# EasyEDA Pro project Armour_Round.eprj, schematic Schematic1
Create Date: 2023-03-10; Page Name: P1; Project Name: Armour_Round; Schematic Name: Schematic1; Update Date: 2023-03-13; Company: 嘉立创EDA; Page Size: A4; Version: V1.0
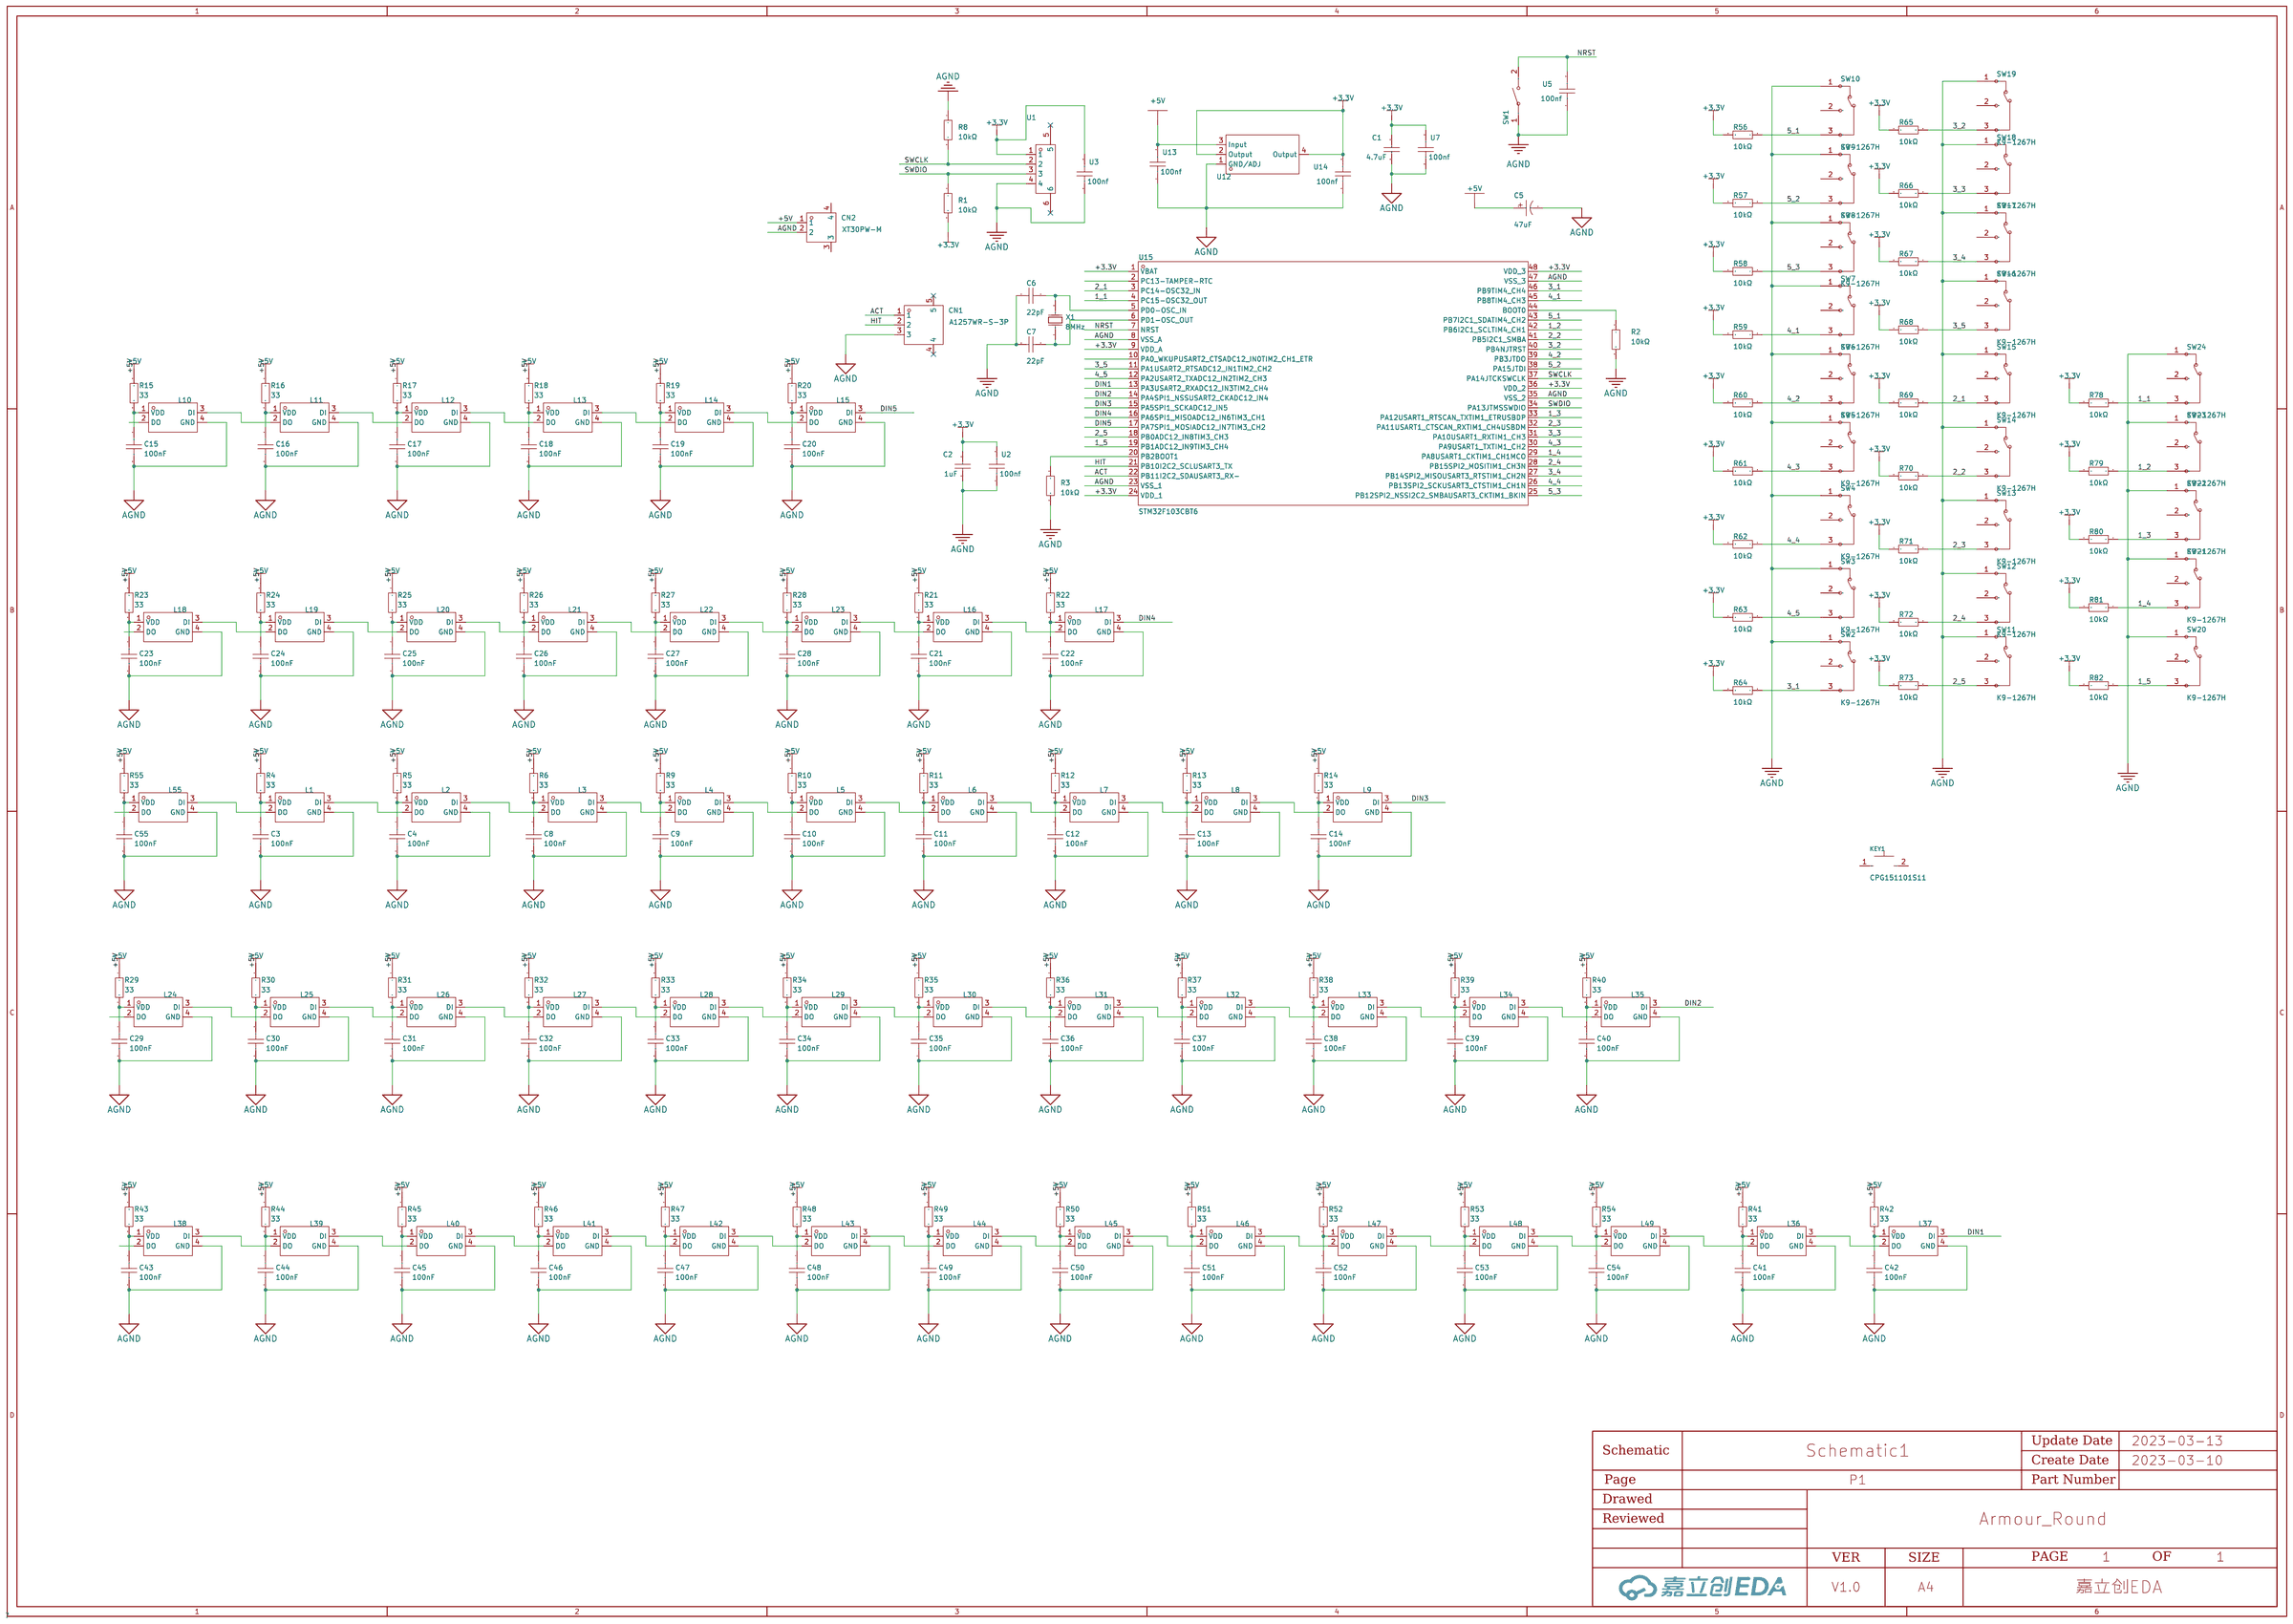
[diagram p0: schematic sheet]

## Parts
C1  4.7uF  [C0603]
C2  1uF  [C0603]
C3  100nF  [C0603]
C4  100nF  [C0603]
C5  47uF  [CAP-SMD_BD6.3-L6.6-W6.6-FD]
C6  22pF  [C0603]
C7  22pF  [C0603]
C8  100nF  [C0603]
C9  100nF  [C0603]
C10  100nF  [C0603]
C11  100nF  [C0603]
C12  100nF  [C0603]
C13  100nF  [C0603]
C14  100nF  [C0603]
C15  100nF  [C0603]
C16  100nF  [C0603]
C17  100nF  [C0603]
C18  100nF  [C0603]
C19  100nF  [C0603]
C20  100nF  [C0603]
C21  100nF  [C0603]
C22  100nF  [C0603]
C23  100nF  [C0603]
C24  100nF  [C0603]
C25  100nF  [C0603]
C26  100nF  [C0603]
C27  100nF  [C0603]
C28  100nF  [C0603]
C29  100nF  [C0603]
C30  100nF  [C0603]
C31  100nF  [C0603]
C32  100nF  [C0603]
C33  100nF  [C0603]
C34  100nF  [C0603]
C35  100nF  [C0603]
C36  100nF  [C0603]
C37  100nF  [C0603]
C38  100nF  [C0603]
C39  100nF  [C0603]
C40  100nF  [C0603]
C41  100nF  [C0603]
C42  100nF  [C0603]
C43  100nF  [C0603]
C44  100nF  [C0603]
C45  100nF  [C0603]
C46  100nF  [C0603]
C47  100nF  [C0603]
C48  100nF  [C0603]
C49  100nF  [C0603]
C50  100nF  [C0603]
C51  100nF  [C0603]
C52  100nF  [C0603]
C53  100nF  [C0603]
C54  100nF  [C0603]
C55  100nF  [C0603]
CN1  A1257WR-S-3P  [CONN-SMD_A1257WR-S-3P]
CN2  XT30PW-M  [CONN-TH_XT30PW-M]
KEY1  CPG151101S11  [TH_L10.9-W5.9-CPG151101S11]
L1  XL-5050RGBC-WS2812B  [LED-SMD_4P-L5.0-W5.0-BL_XL-5050RGBC]
L2  XL-5050RGBC-WS2812B  [LED-SMD_4P-L5.0-W5.0-BL_XL-5050RGBC]
L3  XL-5050RGBC-WS2812B  [LED-SMD_4P-L5.0-W5.0-BL_XL-5050RGBC]
L4  XL-5050RGBC-WS2812B  [LED-SMD_4P-L5.0-W5.0-BL_XL-5050RGBC]
L5  XL-5050RGBC-WS2812B  [LED-SMD_4P-L5.0-W5.0-BL_XL-5050RGBC]
L6  XL-5050RGBC-WS2812B  [LED-SMD_4P-L5.0-W5.0-BL_XL-5050RGBC]
L7  XL-5050RGBC-WS2812B  [LED-SMD_4P-L5.0-W5.0-BL_XL-5050RGBC]
L8  XL-5050RGBC-WS2812B  [LED-SMD_4P-L5.0-W5.0-BL_XL-5050RGBC]
L9  XL-5050RGBC-WS2812B  [LED-SMD_4P-L5.0-W5.0-BL_XL-5050RGBC]
L10  XL-5050RGBC-WS2812B  [LED-SMD_4P-L5.0-W5.0-BL_XL-5050RGBC]
L11  XL-5050RGBC-WS2812B  [LED-SMD_4P-L5.0-W5.0-BL_XL-5050RGBC]
L12  XL-5050RGBC-WS2812B  [LED-SMD_4P-L5.0-W5.0-BL_XL-5050RGBC]
L13  XL-5050RGBC-WS2812B  [LED-SMD_4P-L5.0-W5.0-BL_XL-5050RGBC]
L14  XL-5050RGBC-WS2812B  [LED-SMD_4P-L5.0-W5.0-BL_XL-5050RGBC]
L15  XL-5050RGBC-WS2812B  [LED-SMD_4P-L5.0-W5.0-BL_XL-5050RGBC]
L16  XL-5050RGBC-WS2812B  [LED-SMD_4P-L5.0-W5.0-BL_XL-5050RGBC]
L17  XL-5050RGBC-WS2812B  [LED-SMD_4P-L5.0-W5.0-BL_XL-5050RGBC]
L18  XL-5050RGBC-WS2812B  [LED-SMD_4P-L5.0-W5.0-BL_XL-5050RGBC]
L19  XL-5050RGBC-WS2812B  [LED-SMD_4P-L5.0-W5.0-BL_XL-5050RGBC]
L20  XL-5050RGBC-WS2812B  [LED-SMD_4P-L5.0-W5.0-BL_XL-5050RGBC]
L21  XL-5050RGBC-WS2812B  [LED-SMD_4P-L5.0-W5.0-BL_XL-5050RGBC]
L22  XL-5050RGBC-WS2812B  [LED-SMD_4P-L5.0-W5.0-BL_XL-5050RGBC]
L23  XL-5050RGBC-WS2812B  [LED-SMD_4P-L5.0-W5.0-BL_XL-5050RGBC]
L24  XL-5050RGBC-WS2812B  [LED-SMD_4P-L5.0-W5.0-BL_XL-5050RGBC]
L25  XL-5050RGBC-WS2812B  [LED-SMD_4P-L5.0-W5.0-BL_XL-5050RGBC]
L26  XL-5050RGBC-WS2812B  [LED-SMD_4P-L5.0-W5.0-BL_XL-5050RGBC]
L27  XL-5050RGBC-WS2812B  [LED-SMD_4P-L5.0-W5.0-BL_XL-5050RGBC]
L28  XL-5050RGBC-WS2812B  [LED-SMD_4P-L5.0-W5.0-BL_XL-5050RGBC]
L29  XL-5050RGBC-WS2812B  [LED-SMD_4P-L5.0-W5.0-BL_XL-5050RGBC]
L30  XL-5050RGBC-WS2812B  [LED-SMD_4P-L5.0-W5.0-BL_XL-5050RGBC]
L31  XL-5050RGBC-WS2812B  [LED-SMD_4P-L5.0-W5.0-BL_XL-5050RGBC]
L32  XL-5050RGBC-WS2812B  [LED-SMD_4P-L5.0-W5.0-BL_XL-5050RGBC]
L33  XL-5050RGBC-WS2812B  [LED-SMD_4P-L5.0-W5.0-BL_XL-5050RGBC]
L34  XL-5050RGBC-WS2812B  [LED-SMD_4P-L5.0-W5.0-BL_XL-5050RGBC]
L35  XL-5050RGBC-WS2812B  [LED-SMD_4P-L5.0-W5.0-BL_XL-5050RGBC]
L36  XL-5050RGBC-WS2812B  [LED-SMD_4P-L5.0-W5.0-BL_XL-5050RGBC]
L37  XL-5050RGBC-WS2812B  [LED-SMD_4P-L5.0-W5.0-BL_XL-5050RGBC]
L38  XL-5050RGBC-WS2812B  [LED-SMD_4P-L5.0-W5.0-BL_XL-5050RGBC]
L39  XL-5050RGBC-WS2812B  [LED-SMD_4P-L5.0-W5.0-BL_XL-5050RGBC]
L40  XL-5050RGBC-WS2812B  [LED-SMD_4P-L5.0-W5.0-BL_XL-5050RGBC]
L41  XL-5050RGBC-WS2812B  [LED-SMD_4P-L5.0-W5.0-BL_XL-5050RGBC]
L42  XL-5050RGBC-WS2812B  [LED-SMD_4P-L5.0-W5.0-BL_XL-5050RGBC]
L43  XL-5050RGBC-WS2812B  [LED-SMD_4P-L5.0-W5.0-BL_XL-5050RGBC]
L44  XL-5050RGBC-WS2812B  [LED-SMD_4P-L5.0-W5.0-BL_XL-5050RGBC]
L45  XL-5050RGBC-WS2812B  [LED-SMD_4P-L5.0-W5.0-BL_XL-5050RGBC]
L46  XL-5050RGBC-WS2812B  [LED-SMD_4P-L5.0-W5.0-BL_XL-5050RGBC]
L47  XL-5050RGBC-WS2812B  [LED-SMD_4P-L5.0-W5.0-BL_XL-5050RGBC]
L48  XL-5050RGBC-WS2812B  [LED-SMD_4P-L5.0-W5.0-BL_XL-5050RGBC]
L49  XL-5050RGBC-WS2812B  [LED-SMD_4P-L5.0-W5.0-BL_XL-5050RGBC]
L55  XL-5050RGBC-WS2812B  [LED-SMD_4P-L5.0-W5.0-BL_XL-5050RGBC]
R1  10kΩ  [R0603]
R2  10kΩ  [R0603]
R3  10kΩ  [R0603]
R4  33  [R0402]
R5  33  [R0402]
R6  33  [R0402]
R8  10kΩ  [R0603]
R9  33  [R0402]
R10  33  [R0402]
R11  33  [R0402]
R12  33  [R0402]
R13  33  [R0402]
R14  33  [R0402]
R15  33  [R0402]
R16  33  [R0402]
R17  33  [R0402]
R18  33  [R0402]
R19  33  [R0402]
R20  33  [R0402]
R21  33  [R0402]
R22  33  [R0402]
R23  33  [R0402]
R24  33  [R0402]
R25  33  [R0402]
R26  33  [R0402]
R27  33  [R0402]
R28  33  [R0402]
R29  33  [R0402]
R30  33  [R0402]
R31  33  [R0402]
R32  33  [R0402]
R33  33  [R0402]
R34  33  [R0402]
R35  33  [R0402]
R36  33  [R0402]
R37  33  [R0402]
R38  33  [R0402]
R39  33  [R0402]
R40  33  [R0402]
R41  33  [R0402]
R42  33  [R0402]
R43  33  [R0402]
R44  33  [R0402]
R45  33  [R0402]
R46  33  [R0402]
R47  33  [R0402]
R48  33  [R0402]
R49  33  [R0402]
R50  33  [R0402]
R51  33  [R0402]
R52  33  [R0402]
R53  33  [R0402]
R54  33  [R0402]
R55  33  [R0402]
R56  10kΩ  [R0402]
R57  10kΩ  [R0402]
R58  10kΩ  [R0402]
R59  10kΩ  [R0402]
R60  10kΩ  [R0402]
R61  10kΩ  [R0402]
R62  10kΩ  [R0402]
R63  10kΩ  [R0402]
R64  10kΩ  [R0402]
R65  10kΩ  [R0402]
R66  10kΩ  [R0402]
R67  10kΩ  [R0402]
R68  10kΩ  [R0402]
R69  10kΩ  [R0402]
R70  10kΩ  [R0402]
R71  10kΩ  [R0402]
R72  10kΩ  [R0402]
R73  10kΩ  [R0402]
R78  10kΩ  [R0402]
R79  10kΩ  [R0402]
R80  10kΩ  [R0402]
R81  10kΩ  [R0402]
R82  10kΩ  [R0402]
SW1  -  [KEY-SMD_L6.2-W3.6-LS8.0]
SW2  K9-1267H  [SW-TH_K9-1267H]
SW3  K9-1267H  [SW-TH_K9-1267H]
SW4  K9-1267H  [SW-TH_K9-1267H]
SW5  K9-1267H  [SW-TH_K9-1267H]
SW6  K9-1267H  [SW-TH_K9-1267H]
SW7  K9-1267H  [SW-TH_K9-1267H]
SW8  K9-1267H  [SW-TH_K9-1267H]
SW9  K9-1267H  [SW-TH_K9-1267H]
SW10  K9-1267H  [SW-TH_K9-1267H]
SW11  K9-1267H  [SW-TH_K9-1267H]
SW12  K9-1267H  [SW-TH_K9-1267H]
SW13  K9-1267H  [SW-TH_K9-1267H]
SW14  K9-1267H  [SW-TH_K9-1267H]
SW15  K9-1267H  [SW-TH_K9-1267H]
SW16  K9-1267H  [SW-TH_K9-1267H]
SW17  K9-1267H  [SW-TH_K9-1267H]
SW18  K9-1267H  [SW-TH_K9-1267H]
SW19  K9-1267H  [SW-TH_K9-1267H]
SW20  K9-1267H  [SW-TH_K9-1267H]
SW21  K9-1267H  [SW-TH_K9-1267H]
SW22  K9-1267H  [SW-TH_K9-1267H]
SW23  K9-1267H  [SW-TH_K9-1267H]
SW24  K9-1267H  [SW-TH_K9-1267H]
U1  -  [CONN-SMD_GH1.25-4PWBPZ]
U2  100nf  [C0603]
U3  100nf  [C0603]
U5  100nf  [C0603]
U7  100nf  [C0603]
U12  -  [SOT-223-4_L6.5-W3.5-P2.30-LS7.0-BR]
U13  100nf  [C0603]
U14  100nf  [C0603]
U15  STM32F103CBT6  [LQFP-48_L7.0-W7.0-P0.50-LS9.0-BL]
X1  8MHz  [HC-49S_L11.4-W4.8]

## Library data of the parts
C1 C2 = 0603F475M160NT: 容值:4.7uF;精度:±20%;额定电压:16V;温度系数:Y5V;; LCSC Part Name: 4.7uF ±20% 16V; Supplier Part: C94039; Manufacturer: FH(风华); Supplier Footprint: 0603; JLCPCB Part Class: Extended Part; Datasheet: https://atta.szlcsc.com/upload/public/pdf/source/20171212/C94039_15130640218931178027.pdf; Supplier: LCSC; Tolerance: ±20%; Voltage Rated: 16V; Temperature Coefficient: Y5V
C3 C4 C8-C55 = CC0603KRX7R9BB104: 容值:100nF;精度:±10%;额定电压:50V;材质(温度系数):X7R;; LCSC Part Name: 100nF ±10% 50V; Supplier Part: C14663; Manufacturer: YAGEO(国巨); Supplier Footprint: 0603; JLCPCB Part Class: Basic Part; Datasheet: https://atta.szlcsc.com/upload/public/pdf/source/20170116/1484561234239.pdf; Supplier: LCSC; Tolerance: ±10%; Voltage Rated: 50V; Temperature Coefficient: X7R
C5 = RVT1V470M0605_C3344: 容值:47uF;精度:±20%;额定电压:35V;电容体直径:6.3mm;电容体长度:5.4mm;纹波电流:-;等效串联电阻:-;工作寿命:2000hrs@105℃;工作温度:-55℃~+105℃;; LCSC Part Name: 47uF ±20% 35V; Supplier Part: C3344; Manufacturer: HONOR(荣誉); Manufacturer Part: RVT1V470M0605; Supplier Footprint: SMD,6.3x5.4mm; JLCPCB Part Class: Extended Part; Datasheet: https://atta.szlcsc.com/upload/public/pdf/source/20210521/C113284_25C86AE95FB541053FE695F13EA8E7D0.pdf; Supplier: LCSC; Tolerance: ±20%; Rated Voltage: 35V; φD: 6.3mm; L: 5.4mm; Lifetime @ Temp: 2000hrs@105℃; Operating Temperature: -55℃~+105℃
C6 C7 = CL10C220JB8NNNC: 容值:22pF;精度:±5%;额定电压:50V;材质(温度系数):C0G;; LCSC Part Name: 22pF ±5% 50V; Supplier Part: C1653; Manufacturer: SAMSUNG(三星); Supplier Footprint: 0603; JLCPCB Part Class: Basic Part; Datasheet: https://atta.szlcsc.com/upload/public/pdf/source/20160103/1457707687317.pdf; Supplier: LCSC; Tolerance: ±5%; Voltage Rated: 50V; Temperature Coefficient: C0G
CN1 = A1257WR-S-3P: 参考系列:GH;间距:1.25mm;插针结构:1x3P;排数:1;每排PIN数:3;行距:-;安装方式:-;触头材质:黄铜;; LCSC Part Name: GH1.25卧式贴片 镀锡 3P 针座连接器; Supplier Part: C225126; Manufacturer: CJT(长江连接器); Supplier Footprint: SMD,P=1.25mm; JLCPCB Part Class: Extended Part; Datasheet: https://atta.szlcsc.com/upload/public/pdf/source/20180509/C225126_ADD3D08D2A073BE9D7E4269813B9793A.pdf; Supplier: LCSC; Reference Series: GH; Pitch: 1.25mm; Pins Structure: 1x3P; Number of Rows: 1; Number of PINs Per Row: 3; Contact Material: 黄铜
CN2 = XT30PW-M: Socket,DCsupply,XT30,male,PIN:2; LCSC Part Name: XT30PW-M公头; Supplier Part: C431092; Manufacturer: AMASS(艾迈斯); Supplier Footprint: 插件; JLCPCB Part Class: Extended Part; Datasheet: https://atta.szlcsc.com/upload/public/pdf/source/20220222/6A9F22F7850E25B33E1BE430ADF8560B.pdf; Supplier: LCSC
KEY1 = CPG151101S11: 轴类型:-;工作电压:2V~12V;操作力:-;针脚数:-;; LCSC Part Name: 键盘轴连接器 停产; Supplier Part: C2803348; Manufacturer: Kailh(凯华); Supplier Footprint: SMD; JLCPCB Part Class: 扩展库; Datasheet: https://atta.szlcsc.com/upload/public/pdf/source/20220228/B04A6FE76F6176D3365CC186B3035FED.pdf; Supplier: LCSC; Operating Voltage: 2V~12V
L1-L49 L55 = XL-5050RGBC-WS2812B: 发光颜色:RGB三色;二极管配置:共阳极;透镜颜色:无色透明;主波长:-;峰值波长:625nm；470nm；530nm;光通量(25时):-;测试电流:-;正向电压(VF):5V;发光强度:1000mcd；400mcd；400mcd;功率:-;发光角度:120°;安装方式:正贴;工作温度:-30~+70;; LCSC Part Name: RGB三色 共阳极 正贴 幻彩; Supplier Part: C2843785; Manufacturer: XINGLIGHT(成兴光); Supplier Footprint: SMD,5x5x1.6mm; JLCPCB Part Class: Extended Part; Datasheet: https://atta.szlcsc.com/upload/public/pdf/source/20210708/C2843785_2CEFABF204E2EF27FCE5F6F9FD929633.pdf; Supplier: LCSC; Emitted Color: RGB三色; Diode Configuration: 共阳极; Lens Color: 无色透明; Peak Wavelength: 625nm；470nm；530nm; Viewing Angle: 120°; Mounting Sytle: 正贴; Operating Temperature: -30~+70; Forward Voltage (VF): 5V; Luminous Intensity: 1000mcd；400mcd；400mcd
R1-R3 R8 = ERJ3GEYJ103V: 电阻类型:厚膜电阻;阻值:10kΩ;精度:±5%;功率:100mW;温度系数:±200ppm/℃;最大工作电压:150V;工作温度范围:-55℃~+155℃;; LCSC Part Name: 10kΩ ±5% 100mW; Supplier Part: C169849; Manufacturer: PANASONIC(松下); Supplier Footprint: 0603; JLCPCB Part Class: Extended Part; Datasheet: https://atta.szlcsc.com/upload/public/pdf/source/20180125/C169849_15168663904431303240.pdf; Supplier: LCSC; Type: 厚膜电阻; Tolerance: ±5%; Power(Watts): 100mW; Temperature Coefficient: ±200ppm/℃; Overload Voltage (Max): 150V; Operating Temperature Range: -55℃~+155℃
R4-R6 R9-R55 = RTT0233R0FTH: 电阻类型:厚膜电阻;阻值:33;精度:±1%;功率:62.5mW;温度系数:±100ppm/;最大工作电压:50V;; LCSC Part Name: 33 ±1% 62.5mW; Supplier Part: C102986; Manufacturer: RALEC(旺诠); Supplier Footprint: 0402; JLCPCB Part Class: Extended Part; Datasheet: https://atta.szlcsc.com/upload/public/pdf/source/20170408/1491642688484.pdf; Supplier: LCSC; Type: 厚膜电阻; Tolerance: ±1%; Power(Watts): 62.5mW; Temperature Coefficient: ±100ppm/; Overload Voltage (Max): 50V
R56-R73 R78-R82 = 0402WGF1002TCE: 电阻类型:厚膜电阻;阻值:10kΩ;精度:±1%;功率:62.5mW;温度系数:±100ppm/℃;最大工作电压:50V;工作温度范围:-55℃~+155℃;; LCSC Part Name: 10kΩ ±1% 62.5mW; Supplier Part: C25744; Manufacturer: UNI-ROYAL(厚声); Supplier Footprint: 0402; JLCPCB Part Class: Basic Part; Datasheet: https://atta.szlcsc.com/upload/public/pdf/source/20200306/C422600_1E6D84923E4A46A82E41ADD87F860B5C.pdf; Supplier: LCSC; Type: 厚膜电阻; Tolerance: ±1%; Power(Watts): 62.5mW; Temperature Coefficient: ±100ppm/℃; Overload Voltage (Max): 50V; Operating Temperature Range: -55℃~+155℃
SW1 = K2-1107ST-A4DW-06: 触点电流:50mA;额定电压(DC):12V;绝缘电阻:100MΩ;电路结构:单刀单掷;安装方式:立贴;按钮形状:矩形按钮;带灯:-;作用力:250gf@±30gf;机械寿命:100000;工作温度:-25℃~+85℃;开关长度:6.1mm;开关宽度:3.6mm;开关高度:2.5mm;; LCSC Part Name: 轻触开关 3.6*6.1*2.5; Supplier Part: C118141; Manufacturer: 韩国韩荣; Supplier Footprint: SMD; JLCPCB Part Class: Extended Part; Datasheet: https://atta.szlcsc.com/upload/public/pdf/source/20210810/381712CEF248770C072B585C3485C888.pdf; Supplier: LCSC; Contact Current: 50mA; Voltage Rating (DC): 12V; Insulation Resistance: 100MΩ; Circuit: 单刀单掷; Mounting Style: 立贴; Actuator Style: 矩形按钮; Operating Force: 250gf@±30gf; Mechanical Life: 100000; Operating Temperature: -25℃~+85℃; Switch Length: 6.1mm; Switch Width: 3.6mm; Switch Height: 2.5mm
SW2-SW24 = K9-1267H: 类型:微动开关;额定电流(DC):100mA;额定电压(DC):30V;额定电流(AC):-;额定电压(AC):-;电路结构:单刀双掷;机械寿命:3000000;工作温度:-25℃~+85℃;开关长度:12.7mm;开关宽度:5.6mm;; Supplier Part: C107262; Manufacturer: 韩国韩荣; Supplier Footprint: 插件; JLCPCB Part Class: Extended Part; Datasheet: https://atta.szlcsc.com/upload/public/pdf/source/20210810/CDC3D8EE8578FC6105A48B5BF027A648.pdf; Supplier: LCSC; Type: 微动开关; Contact Current (DC): 100mA; Voltage Rating (DC): 30V; Circuit: 单刀双掷; Mechanical Life: 3000000; Operating Temperature: -25℃~+85℃; Switch Length: 12.7mm; Switch Width: 5.6mm
U1 = GH1.25-4PWBPZ: LCSC Part Name: GH1.25-4P卧贴编带; Supplier Part: C2829253; Manufacturer: BOOMELE(博穆精密); JLCPCB Part Class: Extended Part; Datasheet: https://atta.szlcsc.com/upload/public/pdf/source/20211125/08A09A4909F58AF780B71FE423A00F7E.pdf; Supplier: LCSC
U2 U3 U5 U7 U13 U14 = VJ0603Y104KXAAC: Supplier Part: C511432; Manufacturer: VISHAY(威世); Supplier Footprint: 0603; JLCPCB Part Class: Extended Part; Supplier: LCSC
U12 = AMS1117-3.3_C369933: 输出类型:固定;输出极性:正;输出通道数:1;最大输入电压:18V;输出电压:3.3V;压差:1.3V@800mA;静态电流(地电流):8mA;输出电流:1A;电源纹波抑制比(PRSS):-;噪声:-;特性:-;工作温度:-;; LCSC Part Name: Vin=18V Vout=3.3V 1A; Supplier Part: C369933; Manufacturer: KEXIN(科信); Manufacturer Part: AMS1117-3.3; Supplier Footprint: SOT-223; JLCPCB Part Class: Extended Part; Datasheet: https://atta.szlcsc.com/upload/public/pdf/source/20190724/C369933_94137CB0CFA8D6ABD8E5DA714A2C2C4B.pdf; Supplier: LCSC; Output Type: 固定; Output Polarity: 正; Number of Outputs: 1; Maximum Input Voltage: 18V; Output Voltage: 3.3V; Dropout Voltage: 1.3V@800mA; Quiescent Current (Ground Current): 8mA; Output Current: 1A
U15 = STM32F103CBT6: CPU内核:ARM Cortex-M3;CPU最大主频:72MHz;工作电压范围:2V~3.6V;内部振荡器:有;程序 FLASH容量:128K@x8bit;RAM总容量:20KB;EEPROM/数据 FLASH容量:-;GPIO端口数量:37;ADC(单元数/通道数/位数):1@x10ch/12bit;外设/功能/协议栈:温度传感器；DMA；看门狗；POR；PWM;工作温度范围:-40℃~+85℃;; LCSC Part Name: ARM Cortex-M3 72MHz 闪存：128K@x8bit RAM：20KB; Supplier Part: C8304; Manufacturer: ST(意法半导体); Supplier Footprint: LQFP-48(7x7); JLCPCB Part Class: Extended Part; Datasheet: https://atta.szlcsc.com/upload/public/pdf/source/20140724/1457707170379.pdf; Supplier: LCSC; CPU Core: ARM Cortex-M3; Maximum Frequency: 72MHz; Supply Voltage Range: 2V~3.6V; Internal Oscillator: 有; Program FLASH Size: 128K@x8bit; RAM Size: 20KB; GPIO Ports Number: 37; ADC (Units/Channels/bits): 1@x10ch/12bit; Peripherals / Functions / Protocol Stacks: 温度传感器；DMA；看门狗；POR；PWM; Operating Temperature Range: -40℃~+85℃
X1 = X49SM8MSB2SC: 晶振类型:49SMD;频率:8MHz;频率公差:±10ppm;频率稳定度:±30ppm;负载电容:20pF;工作温度:-20℃~+70℃;; LCSC Part Name: HC-49SMD 8MHz ±10ppm 20pF; Supplier Part: C108703; Manufacturer: YXC(扬兴晶振); Supplier Footprint: HC-49S-SMD-2P; JLCPCB Part Class: Extended Part; Datasheet: https://atta.szlcsc.com/upload/public/pdf/source/20210329/C106809_0E91E60850A780B284B63D653DC40EA4.pdf; Supplier: LCSC; Crystal Type: 49SMD; Frequency Tolerance: ±10ppm; Frequency Stability: ±30ppm; Load Capacitance: 20pF; Operating Temperature: -20℃~+70℃

## Nets
+3.3V: C1.2 C2.2 R1.2 R56.2 R57.2 R58.2 R59.2 R60.2 R61.2 R62.2 R63.2 R64.2 R65.2 R66.2 R67.2 R68.2 R69.2 R70.2 R71.2 R72.2 R73.2 R78.2 R79.2 R80.2 R81.2 R82.2 U1.1 U2.2 U3.2 U7.2 U12.2(Output) U12.4(Output) U14.2 U15.1(VBAT) U15.9(VDD_A) U15.24(VDD_1) U15.36(VDD_2) U15.48(VDD_3)
+5V: C5.1 CN2.1 R4.1 R5.1 R6.1 R9.1 R10.1 R11.1 R12.1 R13.1 R14.1 R15.1 R16.1 R17.1 R18.1 R19.1 R20.1 R21.1 R22.1 R23.1 R24.1 R25.1 R26.1 R27.1 R28.1 R29.1 R30.1 R31.1 R32.1 R33.1 R34.1 R35.1 R36.1 R37.1 R38.1 R39.1 R40.1 R41.1 R42.1 R43.1 R44.1 R45.1 R46.1 R47.1 R48.1 R49.1 R50.1 R51.1 R52.1 R53.1 R54.1 R55.1 U12.3(Input) U13.2
AGND: C1.1 C2.1 C3.2 C4.2 C5.2 C6.1 C7.1 C8.2 C9.2 C10.2 C11.2 C12.2 C13.2 C14.2 C15.2 C16.2 C17.2 C18.2 C19.2 C20.2 C21.2 C22.2 C23.2 C24.2 C25.2 C26.2 C27.2 C28.2 C29.2 C30.2 C31.2 C32.2 C33.2 C34.2 C35.2 C36.2 C37.2 C38.2 C39.2 C40.2 C41.2 C42.2 C43.2 C44.2 C45.2 C46.2 C47.2 C48.2 C49.2 C50.2 C51.2 C52.2 C53.2 C54.2 C55.2 CN1.3 CN2.2 L1.4(GND) L2.4(GND) L3.4(GND) L4.4(GND) L5.4(GND) L6.4(GND) L7.4(GND) L8.4(GND) L9.4(GND) L10.4(GND) L11.4(GND) L12.4(GND) L13.4(GND) L14.4(GND) L15.4(GND) L16.4(GND) L17.4(GND) L18.4(GND) L19.4(GND) L20.4(GND) L21.4(GND) L22.4(GND) L23.4(GND) L24.4(GND) L25.4(GND) L26.4(GND) L27.4(GND) L28.4(GND) L29.4(GND) L30.4(GND) L31.4(GND) L32.4(GND) L33.4(GND) L34.4(GND) L35.4(GND) L36.4(GND) L37.4(GND) L38.4(GND) L39.4(GND) L40.4(GND) L41.4(GND) L42.4(GND) L43.4(GND) L44.4(GND) L45.4(GND) L46.4(GND) L47.4(GND) L48.4(GND) L49.4(GND) L55.4(GND) R2.2 R3.2 R8.1 SW1.1 SW2.1(C) SW3.1(C) SW4.1(C) SW5.1(C) SW6.1(C) SW7.1(C) SW8.1(C) SW9.1(C) SW10.1(C) SW11.1(C) SW12.1(C) SW13.1(C) SW14.1(C) SW15.1(C) SW16.1(C) SW17.1(C) SW18.1(C) SW19.1(C) SW20.1(C) SW21.1(C) SW22.1(C) SW23.1(C) SW24.1(C) U1.4 U2.1 U3.1 U5.1 U7.1 U12.1(GND/ADJ) U13.1 U14.1 U15.8(VSS_A) U15.23(VSS_1) U15.35(VSS_2) U15.47(VSS_3)
1_1: R78.1 SW24.3(NC) U15.4(PC15-OSC32_OUT)
1_2: R79.1 SW23.3(NC) U15.42(PB6I2C1_SCLTIM4_CH1)
1_3: R80.1 SW22.3(NC) U15.33(PA12USART1_RTSCAN_TXTIM1_ETRUSBDP)
1_4: R81.1 SW21.3(NC) U15.29(PA8USART1_CKTIM1_CH1MCO)
1_5: R82.1 SW20.3(NC) U15.19(PB1ADC12_IN9TIM3_CH4)
2_1: R69.1 SW15.3(NC) U15.3(PC14-OSC32_IN)
2_2: R70.1 SW14.3(NC) U15.41(PB5I2C1_SMBA)
2_3: R71.1 SW13.3(NC) U15.32(PA11USART1_CTSCAN_RXTIM1_CH4USBDM)
2_4: R72.1 SW12.3(NC) U15.28(PB15SPI2_MOSITIM1_CH3N)
2_5: R73.1 SW11.3(NC) U15.18(PB0ADC12_IN8TIM3_CH3)
3_1: R64.1 SW2.3(NC) U15.46(PB9TIM4_CH4)
3_2: R65.1 SW19.3(NC) U15.40(PB4NJTRST)
3_3: R66.1 SW18.3(NC) U15.31(PA10USART1_RXTIM1_CH3)
3_4: R67.1 SW17.3(NC) U15.27(PB14SPI2_MISOUSART3_RTSTIM1_CH2N)
3_5: R68.1 SW16.3(NC) U15.11(PA1USART2_RTSADC12_IN1TIM2_CH2)
4_1: R59.1 SW7.3(NC) U15.45(PB8TIM4_CH3)
4_2: R60.1 SW6.3(NC) U15.39(PB3JTDO)
4_3: R61.1 SW5.3(NC) U15.30(PA9USART1_TXTIM1_CH2)
4_4: R62.1 SW4.3(NC) U15.26(PB13SPI2_SCKUSART3_CTSTIM1_CH1N)
4_5: R63.1 SW3.3(NC) U15.12(PA2USART2_TXADC12_IN2TIM2_CH3)
5_1: R56.1 SW10.3(NC) U15.43(PB7I2C1_SDATIM4_CH2)
5_2: R57.1 SW9.3(NC) U15.38(PA15JTDI)
5_3: R58.1 SW8.3(NC) U15.25(PB12SPI2_NSSI2C2_SMBAUSART3_CKTIM1_BKIN)
ACT: CN1.1 U15.22(PB11I2C2_SDAUSART3_RX-)
DIN1: L37.3(DI) U15.13(PA3USART2_RXADC12_IN3TIM2_CH4)
DIN2: L35.3(DI) U15.14(PA4SPI1_NSSUSART2_CKADC12_IN4)
DIN3: L9.3(DI) U15.15(PA5SPI1_SCKADC12_IN5)
DIN4: L17.3(DI) U15.16(PA6SPI1_MISOADC12_IN6TIM3_CH1)
DIN5: L15.3(DI) U15.17(PA7SPI1_MOSIADC12_IN7TIM3_CH2)
HIT: CN1.2 U15.21(PB10I2C2_SCLUSART3_TX)
NRST: SW1.2 U5.2 U15.7(NRST)
SWCLK: R8.2 U1.2 U15.37(PA14JTCKSWCLK)
SWDIO: R1.1 U1.3 U15.34(PA13JTMSSWDIO)
$1N2663: C6.2 U15.5(PD0-OSC_IN) X1.2(OSC2)
$1N2664: C7.2 U15.6(PD1-OSC_OUT) X1.1(OSC1)
$1N2668: R3.1 U15.20(PB2BOOT1)
$1N2669: R2.1 U15.44(BOOT0)
$1N14230: C55.1 L55.1(VDD) R55.2
$1N15135: C3.1 L1.1(VDD) R4.2
$1N15772: C4.1 L2.1(VDD) R5.2
$1N15776: C8.1 L3.1(VDD) R6.2
$1N16353: C9.1 L4.1(VDD) R9.2
$1N16357: C10.1 L5.1(VDD) R10.2
$1N19976: C11.1 L6.1(VDD) R11.2
$1N19979: C12.1 L7.1(VDD) R12.2
$1N20579: C13.1 L8.1(VDD) R13.2
$1N20582: C14.1 L9.1(VDD) R14.2
$1N21259: C15.1 L10.1(VDD) R15.2
$1N21262: C16.1 L11.1(VDD) R16.2
$1N21809: C17.1 L12.1(VDD) R17.2
$1N21812: C18.1 L13.1(VDD) R18.2
$1N22363: C19.1 L14.1(VDD) R19.2
$1N22366: C20.1 L15.1(VDD) R20.2
$1N23436: C21.1 L16.1(VDD) R21.2
$1N23439: C22.1 L17.1(VDD) R22.2
$1N24613: C23.1 L18.1(VDD) R23.2
$1N24616: C24.1 L19.1(VDD) R24.2
$1N24621: C25.1 L20.1(VDD) R25.2
$1N24624: C26.1 L21.1(VDD) R26.2
$1N24628: C27.1 L22.1(VDD) R27.2
$1N24631: C28.1 L23.1(VDD) R28.2
$1N26867: C29.1 L24.1(VDD) R29.2
$1N26871: C30.1 L25.1(VDD) R30.2
$1N26877: C33.1 L28.1(VDD) R33.2
$1N26880: C34.1 L29.1(VDD) R34.2
$1N26885: C32.1 L27.1(VDD) R32.2
$1N26889: C31.1 L26.1(VDD) R31.2
$1N26891: C35.1 L30.1(VDD) R35.2
$1N26894: C36.1 L31.1(VDD) R36.2
$1N26898: C37.1 L32.1(VDD) R37.2
$1N26901: C38.1 L33.1(VDD) R38.2
$1N28307: C39.1 L34.1(VDD) R39.2
$1N28310: C40.1 L35.1(VDD) R40.2
$1N28912: C41.1 L36.1(VDD) R41.2
$1N28915: C42.1 L37.1(VDD) R42.2
$1N30856: C43.1 L38.1(VDD) R43.2
$1N30860: C44.1 L39.1(VDD) R44.2
$1N30866: C47.1 L42.1(VDD) R47.2
$1N30869: C48.1 L43.1(VDD) R48.2
$1N30874: C46.1 L41.1(VDD) R46.2
$1N30878: C45.1 L40.1(VDD) R45.2
$1N30880: C49.1 L44.1(VDD) R49.2
$1N30883: C50.1 L45.1(VDD) R50.2
$1N30887: C51.1 L46.1(VDD) R51.2
$1N30890: C52.1 L47.1(VDD) R52.2
$1N30896: C53.1 L48.1(VDD) R53.2
$1N30899: C54.1 L49.1(VDD) R54.2
Net-(L1-2): L1.2(DO) L55.3(DI)
Net-(L1-3): L1.3(DI) L2.2(DO)
Net-(L2-3): L2.3(DI) L3.2(DO)
Net-(L3-3): L3.3(DI) L4.2(DO)
Net-(L4-3): L4.3(DI) L5.2(DO)
Net-(L5-3): L5.3(DI) L6.2(DO)
Net-(L6-3): L6.3(DI) L7.2(DO)
Net-(L7-3): L7.3(DI) L8.2(DO)
Net-(L8-3): L8.3(DI) L9.2(DO)
Net-(L10-3): L10.3(DI) L11.2(DO)
Net-(L11-3): L11.3(DI) L12.2(DO)
Net-(L12-3): L12.3(DI) L13.2(DO)
Net-(L13-3): L13.3(DI) L14.2(DO)
Net-(L14-3): L14.3(DI) L15.2(DO)
Net-(L16-2): L16.2(DO) L23.3(DI)
Net-(L16-3): L16.3(DI) L17.2(DO)
Net-(L18-3): L18.3(DI) L19.2(DO)
Net-(L19-3): L19.3(DI) L20.2(DO)
Net-(L20-3): L20.3(DI) L21.2(DO)
Net-(L21-3): L21.3(DI) L22.2(DO)
Net-(L22-3): L22.3(DI) L23.2(DO)
Net-(L24-3): L24.3(DI) L25.2(DO)
Net-(L25-3): L25.3(DI) L26.2(DO)
Net-(L26-3): L26.3(DI) L27.2(DO)
Net-(L27-3): L27.3(DI) L28.2(DO)
Net-(L28-3): L28.3(DI) L29.2(DO)
Net-(L29-3): L29.3(DI) L30.2(DO)
Net-(L30-3): L30.3(DI) L31.2(DO)
Net-(L31-3): L31.3(DI) L32.2(DO)
Net-(L32-3): L32.3(DI) L33.2(DO)
Net-(L33-3): L33.3(DI) L34.2(DO)
Net-(L34-3): L34.3(DI) L35.2(DO)
Net-(L36-2): L36.2(DO) L49.3(DI)
Net-(L36-3): L36.3(DI) L37.2(DO)
Net-(L38-3): L38.3(DI) L39.2(DO)
Net-(L39-3): L39.3(DI) L40.2(DO)
Net-(L40-3): L40.3(DI) L41.2(DO)
Net-(L41-3): L41.3(DI) L42.2(DO)
Net-(L42-3): L42.3(DI) L43.2(DO)
Net-(L43-3): L43.3(DI) L44.2(DO)
Net-(L44-3): L44.3(DI) L45.2(DO)
Net-(L45-3): L45.3(DI) L46.2(DO)
Net-(L46-3): L46.3(DI) L47.2(DO)
Net-(L47-3): L47.3(DI) L48.2(DO)
Net-(L48-3): L48.3(DI) L49.2(DO)

Not connected (* = marked no-connect by the designer): CN1 4* 5*; CN2 3 4; KEY1 1 2; L10 2(DO); L18 2(DO); L24 2(DO); L38 2(DO); L55 2(DO); SW2 2(NO); SW3 2(NO); SW4 2(NO); SW5 2(NO); SW6 2(NO); SW7 2(NO); SW8 2(NO); SW9 2(NO); SW10 2(NO); SW11 2(NO); SW12 2(NO); SW13 2(NO); SW14 2(NO); SW15 2(NO); SW16 2(NO); SW17 2(NO); SW18 2(NO); SW19 2(NO); SW20 2(NO); SW21 2(NO); SW22 2(NO); SW23 2(NO); SW24 2(NO); U1 5* 6*; U15 2(PC13-TAMPER-RTC) 10(PA0_WKUPUSART2_CTSADC12_IN0TIM2_CH1_ETR)
